# EAGLE design OnBoardingSystem v0 (EAGLE 9.7.0)
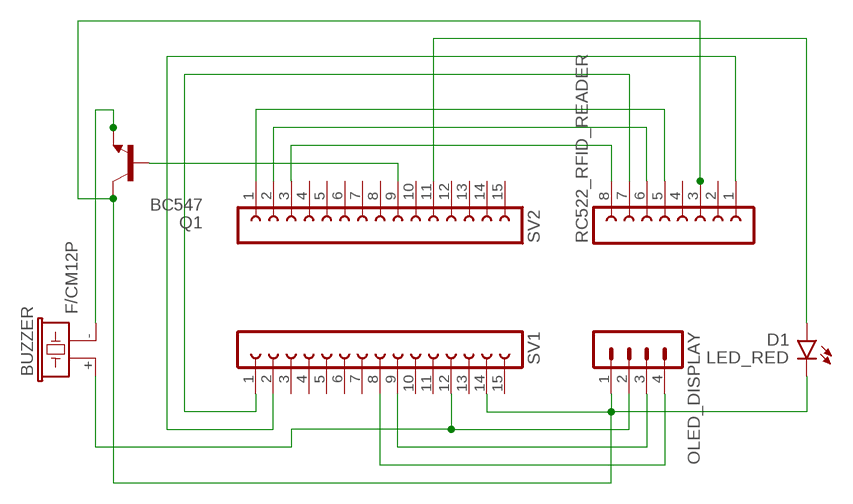
[diagram p0: schematic, sheet 1]

## Parts
BUZZER  F/CM12P  [F/CM12P]
D1  LED_RED  CHIP-ROUND-R_1209  [LEDC3224X250N_RND-R]
OLED_DISPLAY  MA04-1  [MA04-1]
Q1  BC547  [TO92]
RC522_RFID_READER  FE08-1  [FE08]
SV1  FE15-1  [FE15]
SV2  FE15-1  [FE15]

## Nets
N$2: BUZZER.+ OLED_DISPLAY.2 SV1.12
N$3: OLED_DISPLAY.3 SV1.9
N$4: OLED_DISPLAY.4 SV1.8
N$5: RC522_RFID_READER.8 SV2.3
N$6: RC522_RFID_READER.7 SV1.1
N$7: RC522_RFID_READER.6 SV2.2
N$8: RC522_RFID_READER.5 SV2.1
N$9: D1.C OLED_DISPLAY.1 Q1.3(C) RC522_RFID_READER.3 SV1.14
N$10: RC522_RFID_READER.1 SV1.2
N$11: D1.A SV2.11
N$12: Q1.2(B) SV2.9
N$13: BUZZER.- Q1.1(E)
Unconnected: RC522_RFID_READER.2 RC522_RFID_READER.4 SV1.3 SV1.4 SV1.5 SV1.6 SV1.7 SV1.10 SV1.11 SV1.13 SV1.15 SV2.4 SV2.5 SV2.6 SV2.7 SV2.8 SV2.10 SV2.12 SV2.13 SV2.14 SV2.15

## Library data of the parts
BUZZER = buzzer:F/CM12P: BUZZER Source: Buerklin; OC_FARNELL: unknown; OC_NEWARK: unknown
D1 = LED:CHIP-ROUND-R: LED - Generic; CATEGORY: LED; COLOR: RED; DESCRIPTION: CHIP LED ROUND; SUB-CATEGORY: CHIP; TYPE: ROUND_TOP
OLED_DISPLAY = con-lstb:MA04-1: PIN HEADER; OC_FARNELL: unknown; OC_NEWARK: unknown
Q1 = transistor-npn:BC547*: NPN Transistor
RC522_RFID_READER = con-lsta:FE08-1: FEMALE HEADER; OC_FARNELL: unknown; OC_NEWARK: unknown
SV1 SV2 = con-lsta:FE15-1: FEMALE HEADER; OC_FARNELL: unknown; OC_NEWARK: unknown

## Board
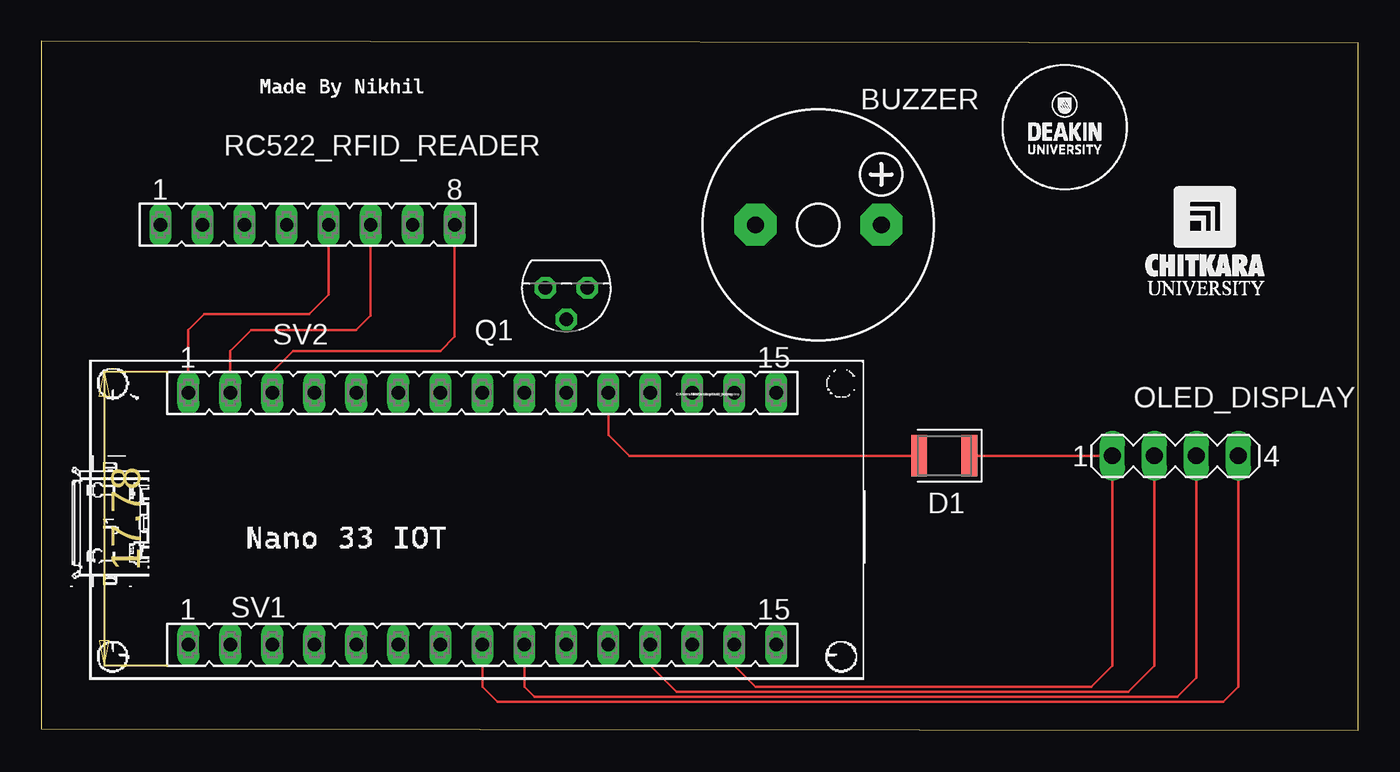
[diagram p1: board, top side]
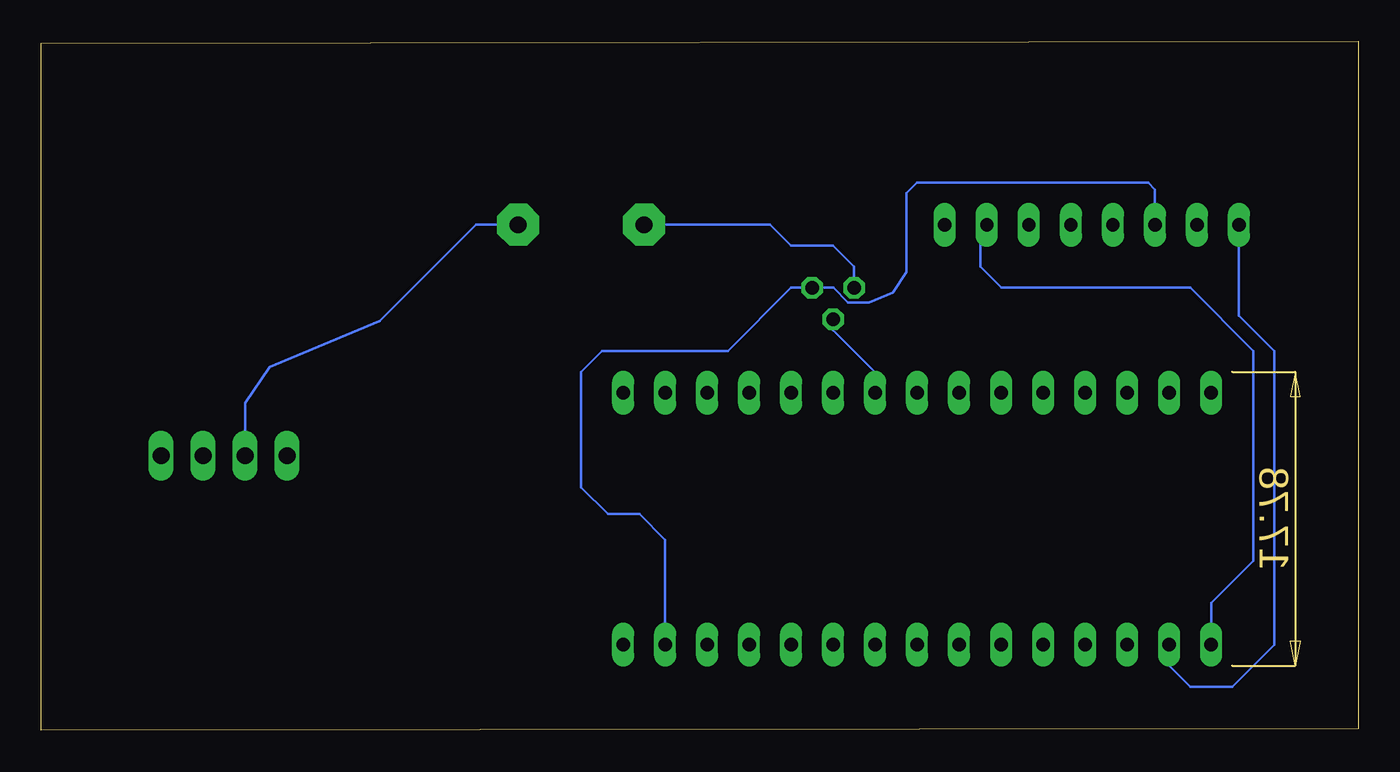
[diagram p2: board, bottom side, seen from below]

Size 79.63 x 41.68 mm. Coordinates in mm from the lower left corner, seen from the top.
Outline: 0,0.1 79.63,0 79.63,41.58 0,41.68 0,0.1
Copper layers (1*16): Top / Bottom
Stack-up Default Layer Stack: Top User Defined 0.035mm / Dielectric-1 User Defined 1.5mm / Bottom User Defined 0.035mm
Design rules "default": minimum track width 6mil, minimum drill 0.35mm, track to track 6mil, track to pad 6mil, pad to pad 6mil, via to via 6mil, smd to smd 6mil, copper to edge 40mil, drill to drill 6mil, minimum pad ring 10mil, minimum via ring 8mil, stop-mask expansion 4mil, vias tented up to drill 0mil, thermal gap 10mil

### Footprints (pad centres in the part's own frame; a part is rotated, then mirrored left to right if it is on the bottom)
F/CM12P = drill 1.016 pad 2.54 octagon: + 3.81,0; - -3.81,0
LEDC3224X250N_RND-R = smd 0.962 x 2.512: A 1.525,0; C -1.525,0
MA04-1 = drill 1.016 long: 1 -3.81,0; 2 -1.27,0; 3 1.27,0; 4 3.81,0
TO92 = drill 0.813 octagon: 1 1.27,0; 2 0,1.905; 3 -1.27,0
FE08 = drill 0.813 long: 1 -8.89,0; 2 -6.35,0; 3 -3.81,0; 4 -1.27,0; 5 1.27,0; 6 3.81,0; 7 6.35,0; 8 8.89,0
FE15 = drill 0.813 long: 1 -17.78,0; 2 -15.24,0; 3 -12.7,0; 4 -10.16,0; 5 -7.62,0; 6 -5.08,0; 7 -2.54,0; 8 0,0; 9 2.54,0; 10 5.08,0; 11 7.62,0; 12 10.16,0; 13 12.7,0; 14 15.24,0; 15 17.78,0

### Placement (x,y rotation side)
BUZZER  46.99,30.58 0 top
D1  54.61,16.61 180 top
OLED_DISPLAY  68.58,16.61 0 top
Q1  31.75,26.77 180 top
RC522_RFID_READER  16.1,30.58 0 top
SV1  26.67,5.18 0 top
SV2  26.67,20.42 0 top

### Tracks (layer width: path | path; a pad name or v marks a point on that pad's centre or on a via)
N$2
  Top 0.152: SV1.12 36.83,3.91 38.4,2.34 65.74,2.34 67.31,3.91 OLED_DISPLAY.2
  Bottom 0.152: BUZZER.+ 53.34,30.58 59.16,24.76 65.84,21.99 67.31,19.79 OLED_DISPLAY.2
N$3
  Top 0.152: SV1.9 29.21,2.64 29.82,2.03 68.71,2.03 69.85,3.18 OLED_DISPLAY.3
N$4
  Top 0.152: OLED_DISPLAY.4 72.39,2.64 71.48,1.73 27.58,1.73 26.67,2.64 SV1.8
N$5
  Top 0.152: SV2.3 13.97,21.69 15.24,22.96 24.13,22.96 24.99,23.83 RC522_RFID_READER.8
N$6
  Bottom 0.152: RC522_RFID_READER.7 22.86,30.18 22.86,28.04 21.59,26.77 10.16,26.77 6.35,22.96 6.35,10.26 8.89,7.72 SV1.1
N$7
  Top 0.152: SV2.2 11.43,22.96 12.7,24.23 19.05,24.23 19.91,25.1 RC522_RFID_READER.6
N$8
  Top 0.152: SV2.1 8.89,24.23 9.86,25.2 16.21,25.2 17.37,26.37 RC522_RFID_READER.5
N$9
  Top 0.152: D1.C OLED_DISPLAY.1 64.77,3.91 63.5,2.64 43.18,2.64 41.91,3.91 SV1.14
  Bottom 0.152: RC522_RFID_READER.3 12.29,32.72 12.7,33.12 26.67,33.12 27.31,32.49 27.31,27.72 28.13,26.49 29.59,25.88 30.85,25.88 31.74,26.77 Q1.3 34.29,26.77 38.1,22.96 45.72,22.96 46.99,21.69 46.99,14.69 45.38,13.08 43.46,13.08 41.91,11.53 SV1.14
N$10
  Bottom 0.152: RC522_RFID_READER.1 7.21,25.1 5.08,22.96 5.08,5.18 7.62,2.64 10.16,2.64 11.43,3.91 SV1.2
N$11
  Top 0.152: D1.A 35.56,16.61 34.29,17.88 SV2.11
N$12
  Bottom 0.152: Q1.2 31.75,24.23 29.21,21.69 SV2.9
N$13
  Bottom 0.152: BUZZER.- 35.56,30.58 34.29,29.31 31.75,29.31 30.48,28.04 Q1.1

### Text on the board
tPlace: C:/Users/Nikhi/Desktop/Deakin Logo.bmp | C:/Users/Nikhi/Desktop/OLED Display.bmp | C:/Users/Nikhi/Desktop/chitkara logo.bmp | C:/Users/Nikhi/Desktop/my name.bmp | C:/Users/Nikhi/Desktop/nano_33.bmp | C:/Users/Nikhi/Desktop/nano_33.bmp | C:/Users/Nikhi/Desktop/nano_port.bmp